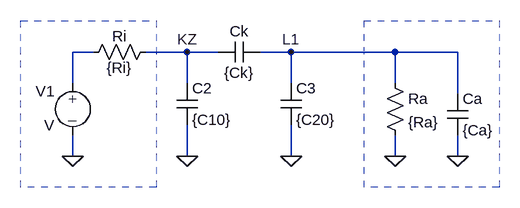
[diagram p0: schematic Draft13.asc]
Draft13.asc, the LTspice schematic file:
Version 4
SHEET 1 880 680
WIRE -144 112 -176 112
WIRE 0 112 -64 112
WIRE 48 112 0 112
WIRE 160 112 112 112
WIRE 320 112 160 112
WIRE 416 112 320 112
WIRE -176 160 -176 112
WIRE 0 160 0 112
WIRE 160 160 160 112
WIRE 320 160 320 112
WIRE 416 176 416 112
WIRE -176 272 -176 240
WIRE 0 272 0 224
WIRE 160 272 160 224
WIRE 320 272 320 240
WIRE 416 272 416 240
FLAG 320 272 0
FLAG 160 272 0
FLAG 0 272 0
FLAG -176 272 0
FLAG 0 112 KZ
FLAG 160 112 L1
FLAG 416 272 0
SYMBOL cap 48 128 R270
WINDOW 0 32 32 VTop 2
WINDOW 3 0 32 VBottom 2
SYMATTR InstName Ck
SYMATTR Value {Ck}
SYMBOL cap -16 160 R0
SYMATTR InstName C2
SYMATTR Value {C10}
SYMBOL cap 144 160 R0
SYMATTR InstName C3
SYMATTR Value {C20}
SYMBOL res -160 128 R270
WINDOW 0 25 56 VTop 2
WINDOW 3 7 56 VBottom 2
SYMATTR InstName Ri
SYMATTR Value {Ri}
SYMBOL res 304 144 R0
SYMATTR InstName Ra
SYMATTR Value {Ra}
SYMBOL BOR_sym\\source-V -176 144 M0
SYMATTR InstName V1
SYMBOL cap 400 176 R0
SYMATTR InstName Ca
SYMATTR Value {Ca}
RECTANGLE Normal -48 320 -256 64 2
RECTANGLE Normal 480 320 272 64 2

The netlist it stands for:
* Draft13.asc
Ck KZ L1 {Ck}
C2 KZ 0 {C10}
C3 L1 0 {C20}
Ri N001 KZ {Ri}
Ra L1 0 {Ra}
V1 N001 0 V
Ca L1 0 {Ca}
.backanno
.end